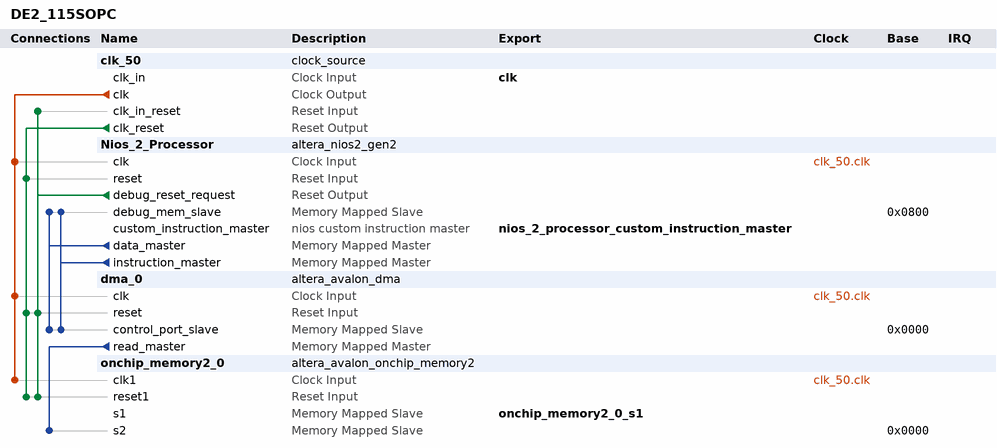
[diagram p0: system contents]
# Platform Designer (Qsys) system DE2_115SOPC, Cyclone IV E EP4CE115F29C7
# Parameters at their usual value, and those the tool derives, are not listed.
package require -exact qsys 18.1
create_system DE2_115SOPC
set_project_property DEVICE_FAMILY {Cyclone IV E}
set_project_property DEVICE EP4CE115F29C7

add_instance clk_50 clock_source 18.1
set_instance_parameter_value clk_50 clockFrequency 50000000

add_instance Nios_2_Processor altera_nios2_gen2 18.1
set_instance_parameter_value Nios_2_Processor dcache_size 2048
set_instance_parameter_value Nios_2_Processor exceptionSlave None
set_instance_parameter_value Nios_2_Processor icache_size 4096
set_instance_parameter_value Nios_2_Processor impl Tiny
set_instance_parameter_value Nios_2_Processor resetSlave None

add_instance dma_0 altera_avalon_dma 18.1
set_instance_parameter_value dma_0 allowByteTransactions true
set_instance_parameter_value dma_0 allowDoubleWordTransactions true
set_instance_parameter_value dma_0 allowHalfWordTransactions true
set_instance_parameter_value dma_0 allowQuadWordTransactions true
set_instance_parameter_value dma_0 burstEnable true
set_instance_parameter_value dma_0 fifoDepth 32
set_instance_parameter_value dma_0 maxBurstSize 256
set_instance_parameter_value dma_0 minimumDmaTransactionRegisterWidth 13

add_instance onchip_memory2_0 altera_avalon_onchip_memory2 18.1
set_instance_parameter_value onchip_memory2_0 dataWidth 32
set_instance_parameter_value onchip_memory2_0 dualPort true
set_instance_parameter_value onchip_memory2_0 initMemContent true
set_instance_parameter_value onchip_memory2_0 initializationFileName onchip_mem.hex
set_instance_parameter_value onchip_memory2_0 memorySize 67108864
set_instance_parameter_value onchip_memory2_0 singleClockOperation true

# connections
add_connection clk_50.clk dma_0.clk clock
add_connection clk_50.clk Nios_2_Processor.clk clock
add_connection clk_50.clk onchip_memory2_0.clk1 clock
add_connection clk_50.clk_reset dma_0.reset reset
add_connection clk_50.clk_reset Nios_2_Processor.reset reset
add_connection clk_50.clk_reset onchip_memory2_0.reset1 reset
add_connection Nios_2_Processor.debug_reset_request clk_50.clk_in_reset reset
add_connection Nios_2_Processor.debug_reset_request dma_0.reset reset
add_connection Nios_2_Processor.debug_reset_request onchip_memory2_0.reset1 reset
add_connection dma_0.read_master onchip_memory2_0.s2 avalon
set_connection_parameter_value dma_0.read_master/onchip_memory2_0.s2 baseAddress 0x0000
add_connection Nios_2_Processor.data_master dma_0.control_port_slave avalon
set_connection_parameter_value Nios_2_Processor.data_master/dma_0.control_port_slave baseAddress 0x0000
add_connection Nios_2_Processor.data_master Nios_2_Processor.debug_mem_slave avalon
set_connection_parameter_value Nios_2_Processor.data_master/Nios_2_Processor.debug_mem_slave baseAddress 0x0800
add_connection Nios_2_Processor.instruction_master dma_0.control_port_slave avalon
set_connection_parameter_value Nios_2_Processor.instruction_master/dma_0.control_port_slave baseAddress 0x0000
add_connection Nios_2_Processor.instruction_master Nios_2_Processor.debug_mem_slave avalon
set_connection_parameter_value Nios_2_Processor.instruction_master/Nios_2_Processor.debug_mem_slave baseAddress 0x0800

# exported interfaces
add_interface clk clock sink
set_interface_property clk EXPORT_OF clk_50.clk_in
add_interface nios_2_processor_custom_instruction_master nios_custom_instruction start
set_interface_property nios_2_processor_custom_instruction_master EXPORT_OF Nios_2_Processor.custom_instruction_master
add_interface onchip_memory2_0_s1 avalon slave
set_interface_property onchip_memory2_0_s1 EXPORT_OF onchip_memory2_0.s1

set_interconnect_requirement {$system} qsys_mm.clockCrossingAdapter HANDSHAKE
set_interconnect_requirement {$system} qsys_mm.enableEccProtection FALSE
set_interconnect_requirement {$system} qsys_mm.insertDefaultSlave FALSE
set_interconnect_requirement {$system} qsys_mm.maxAdditionalLatency 1

save_system DE2_115SOPC.qsys
